# Altium schematic sheet NNP-DWG-125-001-000 PG4 Schematic Drawing Pg5.SchDoc
size B; Organization: Synapse Biomedical Inc.; Address1: 300 Artino St.; Address2: Oberlin, OH 44074; DocumentNumber: 51-2002-01; Revision: 04; SheetNumber: 5; SheetTotal: 8; PageSetup: Record=PageOptions|CenterHorizontal=True|CenterVertical=True|PrintScale=1.09|XCorrection=1.00|YCorrection=1.00|PrintKind=0|BorderSize=5000000|LeftOffset=0|BottomOffset=0|Orientation=2|PaperLength=4318|PaperWidth=2794|Scale=100|PaperSource=7|PrintQuality=-3|MediaType=1|DitherType=10|PrintScaleMode=1|PaperKind=11" x 17"|PaperIndex=17
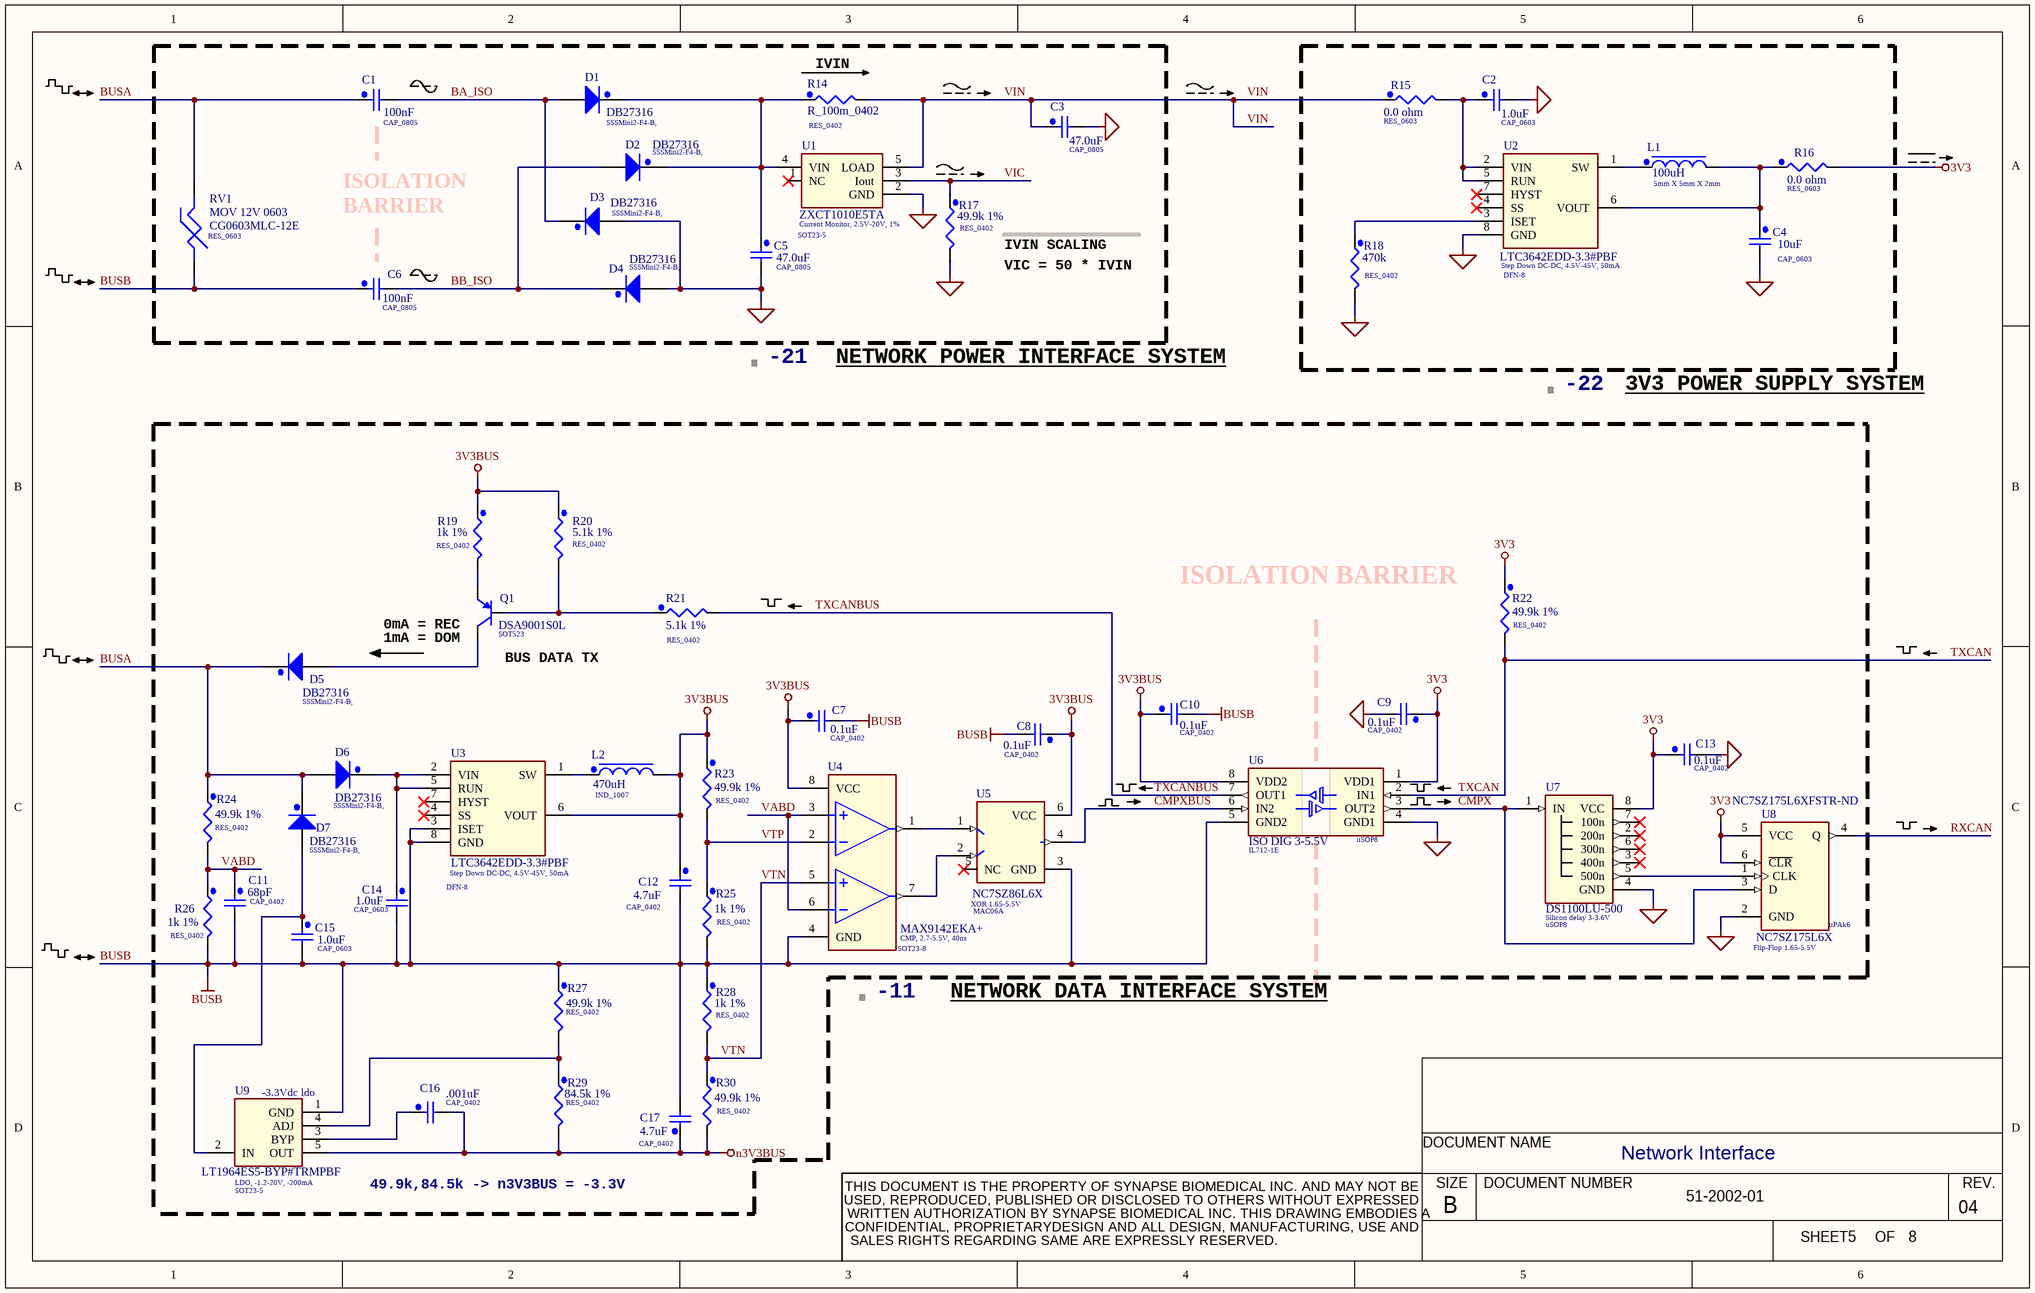
[diagram p0: NNP-DWG-125-001-000 PG4 Schematic Drawing Pg5.SchDoc]

## Parts
-11  XDESCRIPTION: NETWORK DATA INTERFACE SYSTEM  (hidden comment: BOM_S1)  (no BOM)
-21  XDESCRIPTION: NETWORK POWER INTERFACE SYSTEM  (hidden comment: BOM_S1)  (no BOM)
-22  XDESCRIPTION: 3V3 POWER SUPPLY SYSTEM  (hidden comment: BOM_S1)  (no BOM)
C1  value 100nF  [CAP_0805]  (hidden comment: C_100n_X7R_100_0805_10%)
C2  value 1.0uF  [CAP_0603]  (hidden comment: C_1u_X5R_50_0603_10%)
C3  value 47.0uF  [CAP_0805]  (hidden comment: C_47u_X5R_10_0805_20%)
C4  value 10uF  [CAP_0603]  (hidden comment: C_10u_X5R_6V3_0603_20%)
C5  value 47.0uF  [CAP_0805]  (hidden comment: C_47u_X5R_10_0805_20%)
C6  value 100nF  [CAP_0805]  (hidden comment: C_100n_X7R_100_0805_10%)
C7  value 0.1uF  [CAP_0402]  (hidden comment: C_100n_X7R_16_0402_10%)
C8  value 0.1uF  [CAP_0402]  (hidden comment: C_100n_X7R_16_0402_10%)
C9  value 0.1uF  [CAP_0402]  (hidden comment: C_100n_X7R_16_0402_10%)
C10  value 0.1uF  [CAP_0402]  (hidden comment: C_100n_X7R_16_0402_10%)
C11  value 68pF  [CAP_0402]  (hidden comment: C_68p_C0G_50_0402_5%)
C12  value 4.7uF  [CAP_0402]  (hidden comment: C_4u7_X5R_6V3_0402_20%)
C13  value 0.1uF  [CAP_0402]  (hidden comment: C_100n_X7R_16_0402_10%)
C14  value 1.0uF  [CAP_0603]  (hidden comment: C_1u_X5R_50_0603_10%)
C15  value 1.0uF  [CAP_0603]  (hidden comment: C_1u_X5R_50_0603_10%)
C16  value .001uF  [CAP_0402]  (hidden comment: C_10n_X7R_50_0402_20%)
C17  value 4.7uF  [CAP_0402]  (hidden comment: C_4u7_X5R_6V3_0402_20%)
D1  value DB27316  PackageDescription: SSSMini2-F4-B,  [SSSMini2-F4-B]  (hidden comment: D_30_100m)
D2  value DB27316  PackageDescription: SSSMini2-F4-B,  [SSSMini2-F4-B]  (hidden comment: D_30_100m)
D3  value DB27316  PackageDescription: SSSMini2-F4-B,  [SSSMini2-F4-B]  (hidden comment: D_30_100m)
D4  value DB27316  PackageDescription: SSSMini2-F4-B,  [SSSMini2-F4-B]  (hidden comment: D_30_100m)
D5  value DB27316  PackageDescription: SSSMini2-F4-B,  [SSSMini2-F4-B]  (hidden comment: D_30_100m)
D6  value DB27316  PackageDescription: SSSMini2-F4-B,  [SSSMini2-F4-B]  (hidden comment: D_30_100m)
D7  value DB27316  PackageDescription: SSSMini2-F4-B,  [SSSMini2-F4-B]  (hidden comment: D_30_100m)
L1  value 100uH  PackageDescription: 5mm X 5mm X 2mm  [IND-LPS4414]  (hidden comment: L_100u_270m_20%)
L2  value 470uH  [IND_1007]  (hidden comment: 470uH, 35mH, 10%, 10 ohm)
Q1  value DSA9001S0L  [SOT523]  (hidden comment: Q_-50_-100m_SOT523)
R14  R_100m_0402  [RES_0402]
R15  value 0.0 ohm  [RES_0603]  (hidden comment: R_0_0603)
R16  value 0.0 ohm  [RES_0603]  (hidden comment: R_0_0603)
R17  value 49.9k 1%  [RES_0402]  (hidden comment: R_49k9_0402)
R18  value 470k  [RES_0402]  (hidden comment: R_470k_0402)
R19  value 1k 1%  [RES_0402]  (hidden comment: R_1k_0402)
R20  value 5.1k 1%  [RES_0402]  (hidden comment: R_5k1_0402)
R21  value 5.1k 1%  [RES_0402]  (hidden comment: R_5k1_0402)
R22  value 49.9k 1%  [RES_0402]  (hidden comment: R_49k9_0402)
R23  value 49.9k 1%  [RES_0402]  (hidden comment: R_49k9_0402)
R24  value 49.9k 1%  [RES_0402]  (hidden comment: R_49k9_0402)
R25  value 1k 1%  [RES_0402]  (hidden comment: R_1k_0402)
R26  value 1k 1%  [RES_0402]  (hidden comment: R_1k_0402)
R27  value 49.9k 1%  PackageDescription: RES_0402  [CAP_0402]  (hidden comment: R_49k9_0402)
R28  value 1k 1%  [RES_0402]  (hidden comment: R_1k_0402)
R29  value 84.5k 1%  PackageDescription: RES_0402  [CAP_0402]  (hidden comment: R_84k5_0402)
R30  value 49.9k 1%  [RES_0402]  (hidden comment: R_49k9_0402)
RV1  MOV 12V 0603  [RES_0603]
U1  Current Monitor, 2.5V-20V, 1%  [SOT23-5]
U2  Step Down DC-DC, 4.5V-45V, 50mA  PackageDescription: DFN-8  MPN: LTC3642EDD-3.3#PBF  [DFN8]
U3  Step Down DC-DC, 4.5V-45V, 50mA  PackageDescription: DFN-8  MPN: LTC3642EDD-3.3#PBF  [DFN8]
U4  CMP, 2.7-5.5V, 40ns  MPN: MAX9142EKA+  [SOT23-8]
U5  XOR 1.65-5.5V  PackageDescription: MAC06A  [uPak6]
U6  ISO DIG 3-5.5V  PackageDescription: uSOP8  [MSOP-8L]
U7  Silicon delay 3-3.6V  PackageDescription: uSOP8  [MSOP-8L]
U8  Flip-Flop 1.65-5.5V  Supplier Part Number 1: NC7SZ175L6XFSTR-ND  [uPak6]
U9  LDO, -1.2-20V, -200mA  MPN: LT1964ES5-BYP#TRMPBF  [SOT23-5]

## Nets
3V3: C9.1 C13.1 R16.2 R22.1 U6.1(VDD1) U7.8(VCC) U8.5(VCC) U8.6(~{CLR})
3V3BUS: C7.1 C8.1 C10.1 C12.1 L2.2 R19.1 R20.1 R23.1 U3.6(VOUT) U4.8(VCC) U5.6(VCC) U6.8(VDD2)
BUSB: C6.1 C7.2 C8.2 C10.2 C11.2 C12.2 C14.2 C15.2 C17.2 R25.2 R26.2 R27.1 R28.1 RV1.2(P) U3.3(ISET) U3.8(GND) U3.9(BUSB) U4.4(GND) U5.3(GND) U6.5(GND2) U9.1(GND)
GND: C2.2 C3.2 C4.2 C5.2 C9.2 C13.2 D3.2(A) D4.2(A) R17.2 R18.2 U1.2(GND) U2.8(GND) U2.9 U6.4(GND1) U7.4(GND) U8.2(GND)
n3V3BUS: C16.2 C17.1 R29.2 R30.2 U9.5(OUT)
BA_ISO: C1.2 D1.2(A) D3.1(C)
BB_ISO: C6.2 D2.2(A) D4.1(C)
BUSA: C1.1 D5.1(C) D6.2(A) D7.1(C) R24.1 RV1.1(P)
CMPX: U6.3(OUT2) U7.1(IN) U8.3(D)
CMPXBUS: U5.4(O) U6.6(IN2)
RXCAN: U8.4(Q)
TXCAN: R22.2 U6.2(IN1)
TXCANBUS: R21.2 U6.7(OUT1)
VABD: C11.1 R24.2 R26.1 U4.3(INA+) U4.6(INB-)
VIC: R17.1 U1.3(Iout)
VIN: C3.1 R14.2 R15.1 U1.5(LOAD)
VTN: R28.2 R30.1 U4.5(INB+)
VTP: R23.2 R25.1 U4.2(INA-)
NetC2_1: C2.1 R15.2 U2.2(VIN) U2.5(RUN)
NetC4_1: C4.1 L1.2 R16.1 U2.6(VOUT)
NetC5_1: C5.1 D1.1(C) D2.1(C) R14.1 U1.4(VIN)
NetC14_1: C14.1 D6.1(C) U3.2(VIN) U3.5(RUN)
NetC15_1: C15.1 D7.2(A) U9.2(IN)
NetC16_1: C16.1 U9.3(BYP)
NetD5_2: D5.2(A) Q1.3(C)
NetL1_1: L1.1 U2.1(SW)
NetL2_1: L2.1 U3.1(SW)
NetQ1_1: Q1.1(B) R20.2 R21.1
NetQ1_2: Q1.2(E) R19.2
NetR18_1: R18.1 U2.3(ISET)
NetR27_2: R27.2 R29.1 U9.4(ADJ)
NetU4_1: U4.1(OUTA) U5.1(A)
NetU4_7: U4.7(OUTB) U5.2(B)
NetU7_5: U7.5(500n) U8.1(CLK)

Not connected (* = marked no-connect by the designer): U1 1(NC)*; U2 4(SS)* 7(HYST)*; U3 4(SS)* 7(HYST)*; U5 5(NC)*; U7 2(200n)* 3(400n)* 6(300n)* 7(100n)*

## Notes on the sheet
- (near R14) IVIN
- ISOLATION
  BARRIER
- IVIN SCALING
- VIC = 50 * IVIN
- (near Q1) 0mA = REC
- (near Q1) 1mA = DOM
- (near R22) ISOLATION BARRIER
- (near Q1) BUS DATA TX
- (near U9) -3.3Vdc ldo
- Network Interface
- 49.9k,84.5k -> n3V3BUS = -3.3V
- THIS DOCUMENT IS THE PROPERTY OF SYNAPSE BIOMEDICAL INC. AND MAY NOT BE
- DOCUMENT NAME
- SALES RIGHTS REGARDING SAME ARE EXPRESSLY RESERVED.
- USED, REPRODUCED, PUBLISHED OR DISCLOSED TO OTHERS WITHOUT EXPRESSED
- CONFIDENTIAL, PROPRIETARYDESIGN AND ALL DESIGN, MANUFACTURING, USE AND
- WRITTEN AUTHORIZATION BY SYNAPSE BIOMEDICAL INC. THIS DRAWING EMBODIES A
- SIZE
- B
- DOCUMENT NUMBER
- SHEET
- OF
- REV.

## Library data of the parts
-11 -21 -22 = BOM_S1: BOM item small graphic
C1 C6 = 08051C104KAZ2A: 0.1uF, 100V, X7R, 0805, 10%, RoHS; MFR: Murata; MPN: GRM155R71C104KA88D; VTPN: CC5100-KBX1ARC9; NNPN: 00-20-1071; PackageDescription: CAP_0805; Supplier 1: Digi-Key; Supplier Part Number 1: 490-8051-6-ND
C2 = UMK107BJ105KA-T: 1uF, 50V, X5R, 10%, 0603, RoHS; MFR: Murata Electronics North America; MPN: GRM188R61H105KAALD; VTPN: CC6100-KHA50RC7; SBI: 53-0037; MNP2: GRT188R61H105KE13D; NNPN: 00-20-1078; PackageDescription: CAP_0603; Supplier 1: Digi-Key; Supplier Part Number 1: 490-10732-6-ND; Parameter 1: *; MPN2: GRT188R61H105KE13D; Supplier Part Number 2: 490-12330-2-ND; Name Value: *
C3 C5 = C2012X5R1A476M125AC: 47uF, 10V, X5R, 20%, 0805, RoHS; MFR: TDK Corporation; VTPN: CC7470-MBA10RC7; SBI: 53-0038; NNPN: 00-20-1606; PackageDescription: CAP_0805; Supplier 1: Digi-Key; Supplier Part Number 1: 445-8239-6-ND; MPN: C2012X5R1A476M125AC
C4 = ECJ-1VB0J106M: 10uF, 6.3V, X5R, 0603_20%, RoHS; MFR: Murata Electronics North America; MPN: GRM188R60J106ME47J; VTPN: CC7100-MHA06R10; SBI: 53-0039; NNPN: 00-20-1586; PackageDescription: CAP_0603; Supplier 1: Digi-Key; Supplier Part Number 1: 490-6405-6-ND
C7-C10 C13 = GRM155R71C104KA88D: 0.1uF, 16V, X7R, 0402, RoHS; MFR: Murata Electronics North America; VTPN: CC5100-KJX16R13; SBI: 51-0040-1; NNPN: 00-20-1072; PackageDescription: CAP_0402; Supplier 1: Digi-Key; Supplier Part Number 1: 490-3261-2-ND; MPN: GRM155R71C104KA88D
C11 = GRM1555C1H680JZ01D: 68pF, 50V, C0G, 0402, 5%, RoHS; MFR: Murata Electronics North America; VTPN: CC1680-JJN50RC9; SBI: 51-0041-1; NNPN: 00-20-0557; PackageDescription: CAP_0402; Supplier 1: Digi-Key; Supplier Part Number 1: 490-5876-6-ND; MPN: GRM1555C1H680JZ01D
C12 C17 = ECJ-0EB0J475M: 4.7uF, 6.3V, X5R, 20%, 0402, RoHS; MFR: Murata Electronics North America; MPN: GRM155R60J475ME47D; VTPN: CC6470-MJA06R16; SBI: 51-0042; NNPN: 00-20-0755; PackageDescription: CAP_0402; Supplier 1: Digi-Key; Supplier Part Number 1: 490-5915-6-ND
C14 C15 = UMK107BJ105KA-T: 1uF, 50V, X5R, 10%, 0603, RoHS; MFR: Murata Electronics North America; MPN: GRM188R61H105KAALD; VTPN: CC6100-KHA50RC7; SBI: 53-0037; NNPN: 00-20-1078; PackageDescription: CAP_0603; Supplier 1: Digi-Key; Supplier Part Number 1: 490-10732-6-ND; MPN2: GRT188R61H105KE13D; Supplier Part Number 2: 490-12330-2-ND
  C14: Parameter 1: *
C16 = C0402C103M5RACTU: 0.001uF, 50V, X7R, 20%, 0402, RoHS; MFR: Murata Electronics North America; MPN: GJM1555C1H1R0BB01D; VTPN: CC4100-MJX50RC7; SBI: 53-0043; NNPN: 00-20-0628; PackageDescription: CAP_0402; Supplier 1: Digi-Key; Supplier Part Number 1: 490-6073-6-ND
D1-D7 = DB27316: Schotty Diode, 30V, 100mA, RoHS; MFR: Panasonic Electronic Components; VTPN: DRDB2731-S0RC7; SBI: 54-0075; NNPN: 00-05-1012; Supplier 1: Digi-Key; Supplier Part Number 1: DB2731600LCT-ND; MPN: DB27316
L1 = LPS4414-104MLC: 100uH, 270mA, 20%, RoHS; MFR: TDK; MPN: VLCF5020T-101MR27; VTPN: IS5100-M000RC7; SBI: 53-0032; Supplier 1: Digi-Key; NNPN: 00-45-0051; Supplier Part Number 1: 445-3203-1-ND
L2 = CB2518T471K: 470uH, 35mA, 10%, RoHS; MFR: Taiyo Yuden; VTPN: IS5470-K000RC7; SBI: 53-0033; Supplier 1: Digi-Key; PackageDescription: IND_1007; NNPN: 00-45-0052; Supplier Part Number 1: 587-2194-6-ND; MPN: CB2518T471K
Q1 = DSA9001: PNP, -50V, -100mA, SOT523, 150MHz, RoHS; MFR: Panasonic Electronic Components; VTPN: TSDSA900-S0RC7; SBI: 54-0050; PackageDescription: SOT523; NNPN: 00-06-2520; Supplier 1: Digi-Key; Supplier Part Number 1: DSA9001S0LDKR-ND; MPN: DSA9001S0L
R14 = RP1005S-R10-F: 0.1 ohm, 1%, 1/16W, 0402, RoHS; MFR: Vishay Dale; MPN: RCWE0402R100FNEA; Value: 0.1; VTPN: RC8100-FI006RC7; SBI: 53-0049-1; NNPN: 00-11-1025; PackageDescription: RES_0402; Supplier 1: Digi-Key; Supplier Part Number 1: 541-2711-6-ND
R15 R16 = MCR03ERTJ000: 0.0 ohm, 1/10W, 0603, RoHS; MFR: Vishay Dale; VTPN: RC0000-BH010RC9; SBI: 53-0050; NNPN: 00-11-2000; PackageDescription: RES_0603; Supplier 1: Digi-Key; Supplier Part Number 1: RHM0.0CGCT-ND; MPN: MCR03ERTJ000
R17 R22-R24 R27 R30 = MCR01MZPF4992: 49.9k ohm, 1%, 1/16W, 0402, RoHS; MFR: Vishay Dale; MPN: CRCW040249K9FKED; VTPN: RC4499-FI006RC9; SBI: 53-0049-2; NNPN: 00-11-1455; Supplier 1: Digi-Key; Supplier Part Number 1: 541-49.9KLDKR-ND
  R17 R22-R24 R30: PackageDescription: RES_0402
R18 = ERJ-2RKF4703X: 470k ohm, 1% , 1/16W, smd, 0402, RoHS; MFR: Vishay Dale; MPN: CRCW0402470KFKED; VTPN: RC5470-FI006RC9; sbi: 53-0049-3; NNPN: 00-11-1598; PackageDescription: RES_0402; Supplier 1: Digi-Key; Supplier Part Number 1: 541-470KLDKR-ND
R19 R25 R26 R28 = MCR01MZPF1001: 1.0k ohm, 1%, 1/16W, smd, 0402, RoHS; MFR: Vishay Dale; MPN: CRCW04021K00FKED; VTPN: RC3100-FI006R16; sbi: 53-0049-4; NNPN: 00-11-1292; PackageDescription: RES_0402; Supplier 1: Digi-Key; Supplier Part Number 1: 541-1.00KLDKR-ND
R20 R21 = MCR01MZPF5101: 5.1K ohm, 1%, 1/16W, smd, 0402, RoHS; MFR: Vishay Dale; MPN: CRCW04025K10FKED; VTPN: RC3510-FI006RC7; sbi: 53-0049-5; NNPN: 00-11-1585; PackageDescription: RES_0402; Supplier 1: Digi-Key; Supplier Part Number 1: 541-5.10KLDKR-ND
R29 = ERJ-2RKF8452X: 84.5k ohm, 1%, 1/10W, 0402, RoHS; MFR: Vishay Dale; MPN: CRCW040284K5FKED; VTPN: RC4845-FI006RC7; SBI: 53-0051; NNPN: 00-11-1477; Supplier 1: Digi-Key; Supplier Part Number 1: 541-84.5KLDKR-ND
RV1 = CG0603MLC-12E: MOV, 12V, 0603, RoHS; MFR: Bourns; VTPN: TNCG0603-S0RC7; SBI: 53-0066; NNPN: 00-15-1002; PackageDescription: RES_0603; Supplier 1: Digi-Key; Supplier Part Number 1: CG0603MLC-12EDKR-ND; Value: 12V; MPN: CG0603MLC-12E
U1 = ZXCT1010E5TA: Current Monitor, 2.5V-20V, 1%, RoHS; MFR: Diodes Incorporated; VTPN: EASZXCT10-SRC7; SBI: 54-0052; ComponentLink1URL: Q:\00\04\00-04-3500 Zetex ZXCT1010.pdf; NNPN: 00-04-3500; PackageDescription: SOT23-5; Supplier 1: Digi-Key; Supplier Part Number 1: ZXCT1010DKR-ND; MPN: ZXCT1010E5TA
U2 U3 = LTC3642EDD: Step Down DC-DC, 4.5V-45V, 50mA, RoHS; MFR: Linear Technology; Note: VOUT=3.3V; VTPN: ELRLTC364-SRC7; SBI: 54-0053; NNPN: 00-03-1002; Supplier 1: Digi-Key; Supplier Part Number 1: LTC3642EDD-3.3#PBF-ND
U4 = MAX9142EKA: Comparator, 2.7-5.5V, 40nS, SOT23-8, RoHS; MFR: Maxim Integrated; VTPN: ERVMAX914-SRC7; SBI: 54-0054; PackageDescription: SOT23-8; NNPN: 00-03-2004; Supplier 1: Digi-Key; Supplier Part Number 1: MAX9142EKA+TDKR-ND
U5 = NC7SZ86L6X: XOR, 1.65-5.5V, uPAK6, RoHS; MFR: Fairchild Semiconductor; VTPN: EASNC7SZ8-SRC7; SBI: 54-0055; ComponentLink1URL: Q:\00\04\00-04-1016 Fairchild NC7SZ86.pdf; NNPN: 00-04-1016; Supplier 1: Mouser; Supplier Part Number 1: NC7SZ86L6XDKR-ND; MPN: NC7SZ86L6X
U6 = IL712-1E: Digital Isolator, 3-5.5V, uSOP8, RoHS; MFR: Maxim Integrated; SBI: 54-0056; Supplier 1: Digi-Key; Supplier Part Number 1: 390-1105-5-ND; MPN: IL712-1E
U7 = DS1100LU-500: Silicon delay,  3-3.6V, uSOP8, RoHS; MFR: Maxim Integrated; SBI: 54-0057; Value: *; MPN: DS1100LU-500; Supplier 1: Digi-Key; Supplier Part Number 1: DS1100LU-500+-ND
U8 = NC7SZ175L6X: FLIPFLOP, 1.65-5.5V, uPAk6, RoHS; MFR: Fairchild Semiconductor; SBI: 54-0058; ComponentLink1URL: Q:\00\04\00-04-1007 Fairchild NC7SZ175.pdf; PackageDescription: uPAk6; MPN: NC7SZ175L6X; Supplier 1: Digi-Key
U9 = LT1964ES5-BYP: Low Droupout negative regulator, -5V, -200mA; MFR: Linear Technology; SBI: 53-0059; PackageDescription: SOT23-5; Supplier 1: Digi-Key; Supplier Part Number 1: LT1964IS5-BYP#TRMPBFTR-ND